# EAGLE design colorround (EAGLE 8.7.0)
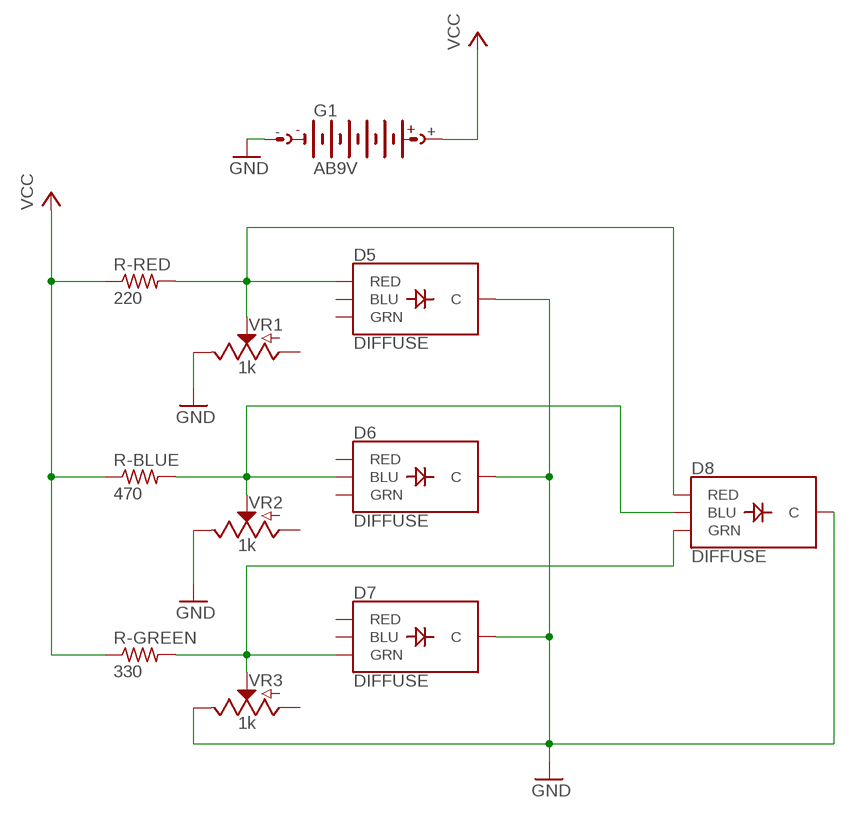
[diagram p0: schematic, sheet 1]

## Parts
D5  DIFFUSE  LED-RGB-CCDIFFUSE  [LED-RGB-THRU]
D6  DIFFUSE  LED-RGB-CCDIFFUSE  [LED-RGB-THRU]
D7  DIFFUSE  LED-RGB-CCDIFFUSE  [LED-RGB-THRU]
D8  DIFFUSE  LED-RGB-CCDIFFUSE  [LED-RGB-THRU]
G1  AB9V  [AB9V]
R-BLUE  470  R-US_0207/10  [0207/10]
R-GREEN  330  R-US_0207/10  [0207/10]
R-RED  220  R-US_0207/10  [0207/10]
VR1  1k  POTENTIOMETER-PTH-9MM-1/20W-20%  [POT-PTH-ALPS]
VR2  1k  POTENTIOMETER-PTH-9MM-1/20W-20%  [POT-PTH-ALPS]
VR3  1k  POTENTIOMETER-PTH-9MM-1/20W-20%  [POT-PTH-ALPS]

## Nets
GND: D5.2(C) D6.2(C) D7.2(C) D8.2(C) G1.- VR1.P$1(E) VR2.P$1(E) VR3.P$1(E)
N$1: D5.1(RED) D8.1(RED) R-RED.2 VR1.P$2(S)
N$2: D6.4(BLU) D8.4(BLU) R-BLUE.2 VR2.P$2(S)
N$3: D7.3(GRN) D8.3(GRN) R-GREEN.2 VR3.P$2(S)
VCC: G1.+ R-BLUE.1 R-GREEN.1 R-RED.1
Unconnected: D5.3(GRN) D5.4(BLU) D6.1(RED) D6.3(GRN) D7.1(RED) D7.4(BLU) VR1.P$3(A) VR2.P$3(A) VR3.P$3(A)

## Library data of the parts
D5-D8 = SparkFun-LED:LED-RGB-CC: LED-RGB Common Cathode Packages: LED RGB-THRU LED_PIRANHA_5MM SparkFun Products: RGB Diffused Common Cathode- Diffuse <[https://www.sparkfun.com/products/9264]> RGB Diffused Common Cathode - Clear <[https://www.sparkfun.com/products/105]> LED-RGB 5mm Square (Piranha) <[https://www.sparkfun.com/products/11679]>; PROD_ID: DIO-09434
G1 = battery:AB9V: 9-V BATTERY CLIP
R-BLUE R-GREEN R-RED = rcl:R-US_: RESISTOR, American symbol
VR1-VR3 = SparkFun-Resistors:POTENTIOMETER: Potentiometer (Pot) Three-terminal potentiometers, with an adjustable wiper and two adjustable resistors. A pot can be used to create a configurable voltage divider, or as a variable resistor. Variants ALPS_POT and ALPS_POT_KIT - PTH, breadboard compatible, 9mm square pots Rotary Potentiometer - Linear (10k ohm) <https://www.sparkfun.com/products/9288> (COM-09288) The KIT variant exposes copper on only one side of the PTH pad, so the part can only be assembled on one side of the PCB. Useful for beginner soldering kits.; PROD_ID: RES-09177; SF_SKU: COM-09288; VALUE: 10k

## Board
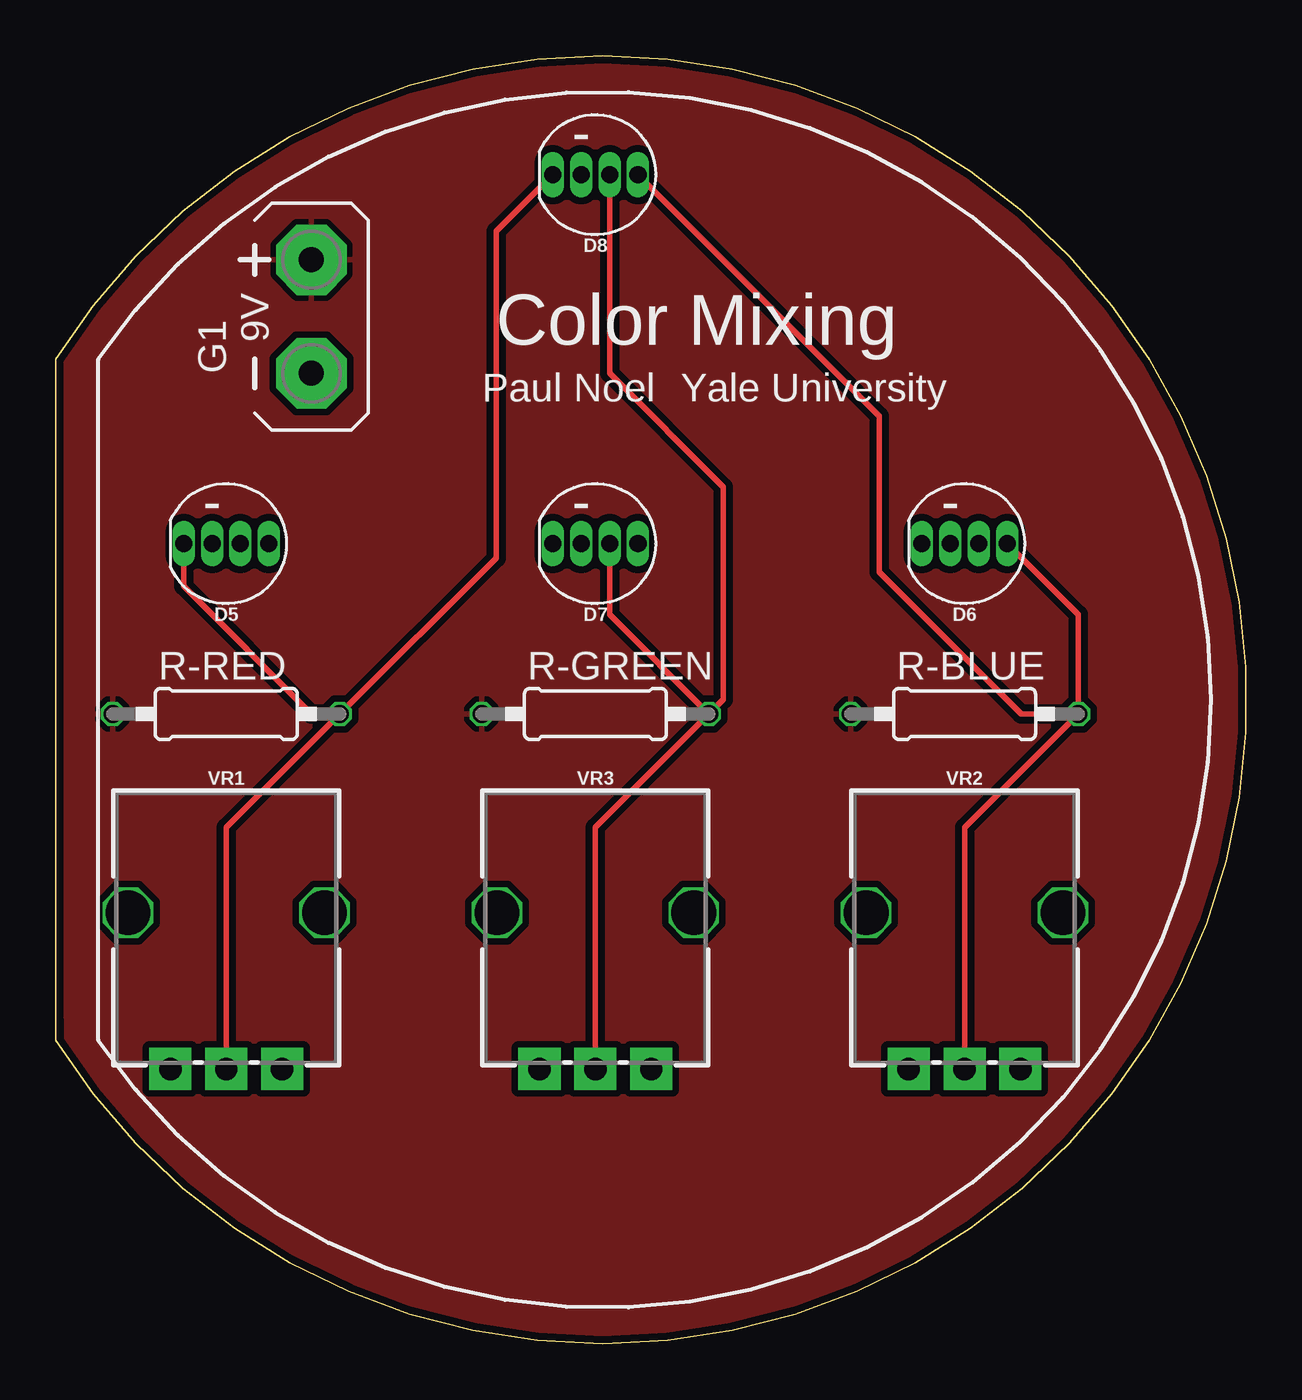
[diagram p1: board, top side]
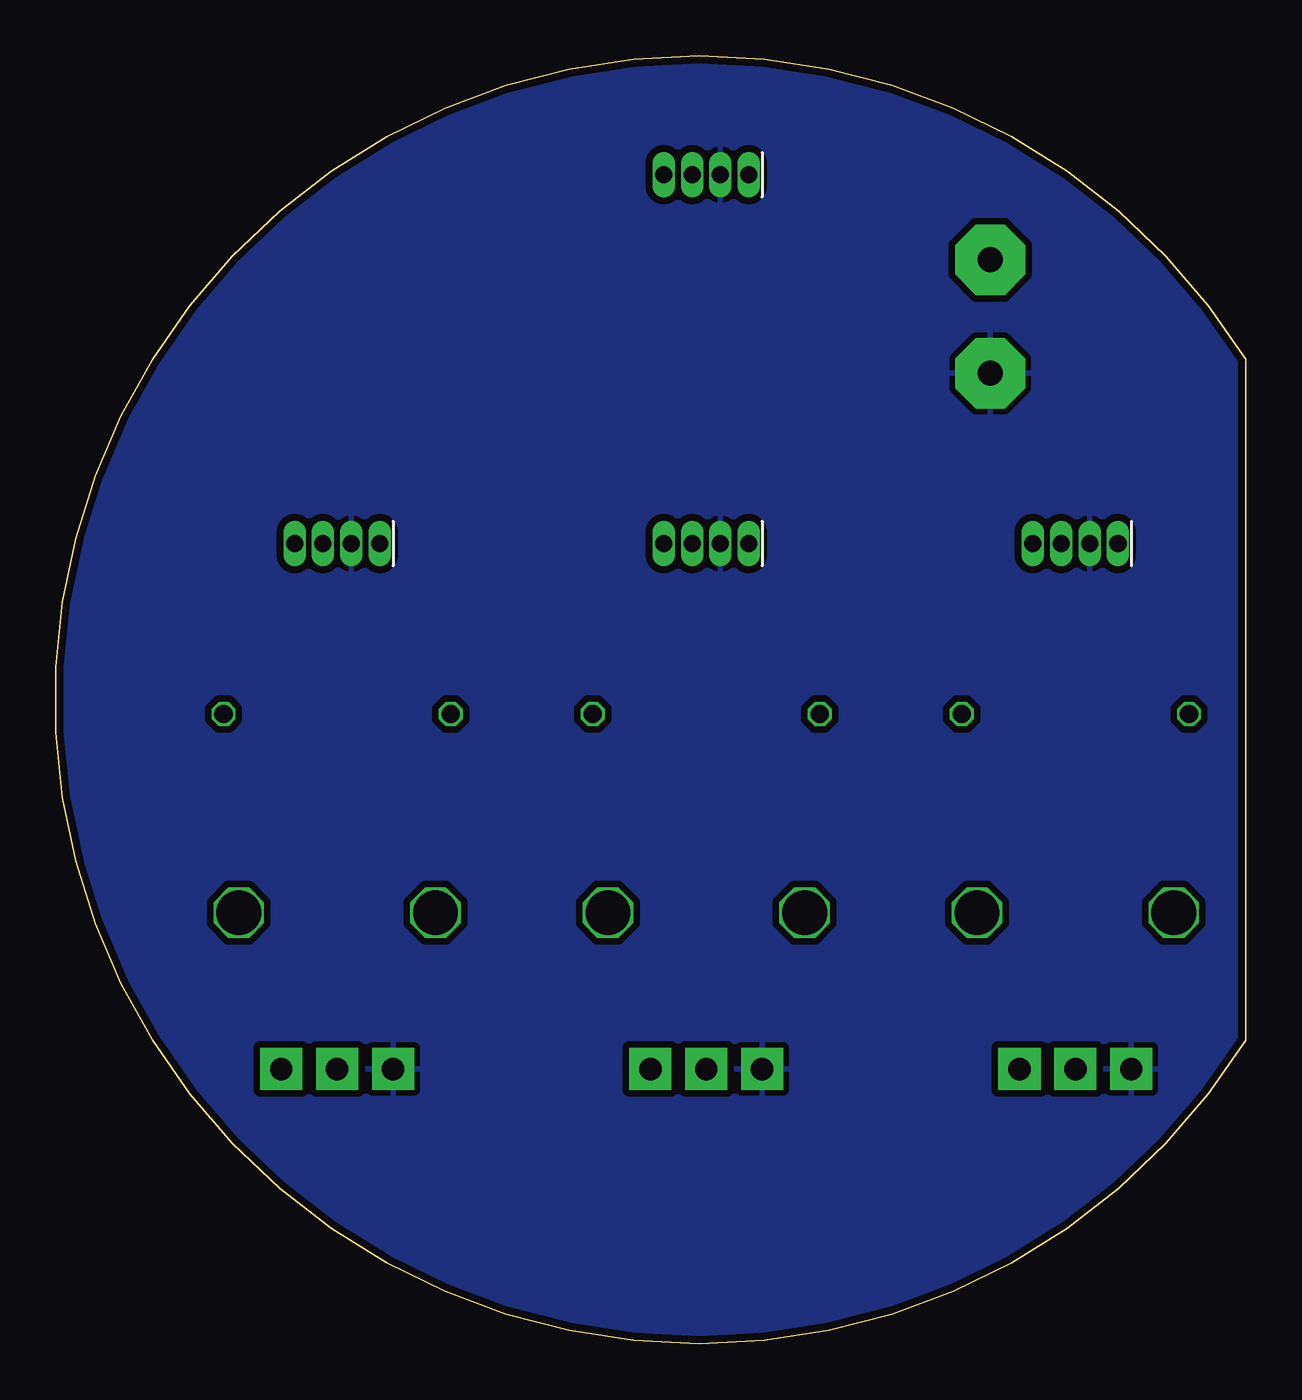
[diagram p2: board, bottom side, seen from below]

Size 53.22 x 57.62 mm. Coordinates in mm from the lower left corner, seen from the top.
Outline: 0,44.05 0,13.57 arc296 0,44.05
Copper layers (1*16): Top 0.035mm / dielectric 1.5mm / Bottom 0.035mm
Design rules "SparkFun *": minimum track width 8mil, minimum drill 20mil, track to track 8mil, track to pad 8mil, pad to pad 8mil, via to via 8mil, smd to smd 8mil, copper to edge 8mil, drill to drill 8mil, minimum pad ring 5mil, minimum via ring 10mil, stop-mask expansion 4mil, vias tented up to drill 20mil, thermal gap 10mil

### Footprints (pad centres in the part's own frame; a part is rotated, then mirrored left to right if it is on the bottom)
LED-RGB-THRU = drill 0.762 pad 0.889 long: 1 1.905,0; 2 0.635,0; 3 -0.635,0; 4 -1.905,0
AB9V = drill 1.118 pad 3.15 octagon: + 0,2.54; - 0,-2.54
0207/10 = drill 0.813 octagon: 1 -5.08,0; 2 5.08,0
POT-PTH-ALPS = drill 1 pad 1.88 square: P$1 7,-2.5; P$2 7,0; P$3 7,2.5 | drill 2 octagon: P$4 0,-4.4; P$5 0,4.4

### Placement (x,y rotation side)
D5  7.62,35.79 180 top
D6  40.64,35.79 180 top
D7  24.13,35.79 180 top
D8  24.13,52.3 180 top
G1  11.43,45.95 0 top
R-BLUE  40.64,28.17 0 top
R-GREEN  24.13,28.17 0 top
R-RED  7.62,28.17 0 top
VR1  7.62,19.28 270 top
VR2  40.64,19.28 270 top
VR3  24.13,19.28 270 top

### Tracks (layer width: path | path; a pad name or v marks a point on that pad's centre or on a via)
GND
  pour Bottom (isolate 0.305): 0,57.38 0,-0.4 53.34,0.23 53.34,58.02
N$1
  Top 0.254: D8.1 19.69,49.76 19.69,35.16 R-RED.2 | D5.1 5.71,33.89 11.43,28.17 R-RED.2 | R-RED.2 7.62,23.09 VR1.P$2
N$2
  Top 0.254: D6.4 45.72,32.62 R-BLUE.2 | VR2.P$2 40.64,23.09 R-BLUE.2 | D8.4 36.83,41.51 36.83,34.52 43.18,28.17 R-BLUE.2
N$3
  Top 0.254: VR3.P$2 24.13,23.09 R-GREEN.2 | D7.3 24.77,32.62 R-GREEN.2 | R-GREEN.2 29.84,28.81 29.84,38.33 24.77,43.41 D8.3
VCC
  pour Top (isolate 0.305): 0,57.38 0.63,-0.4 53.97,0.23 53.34,58.02

### Text on the board
tPlace: - | Color Mixing | Paul Noel | Yale University | - | - | -